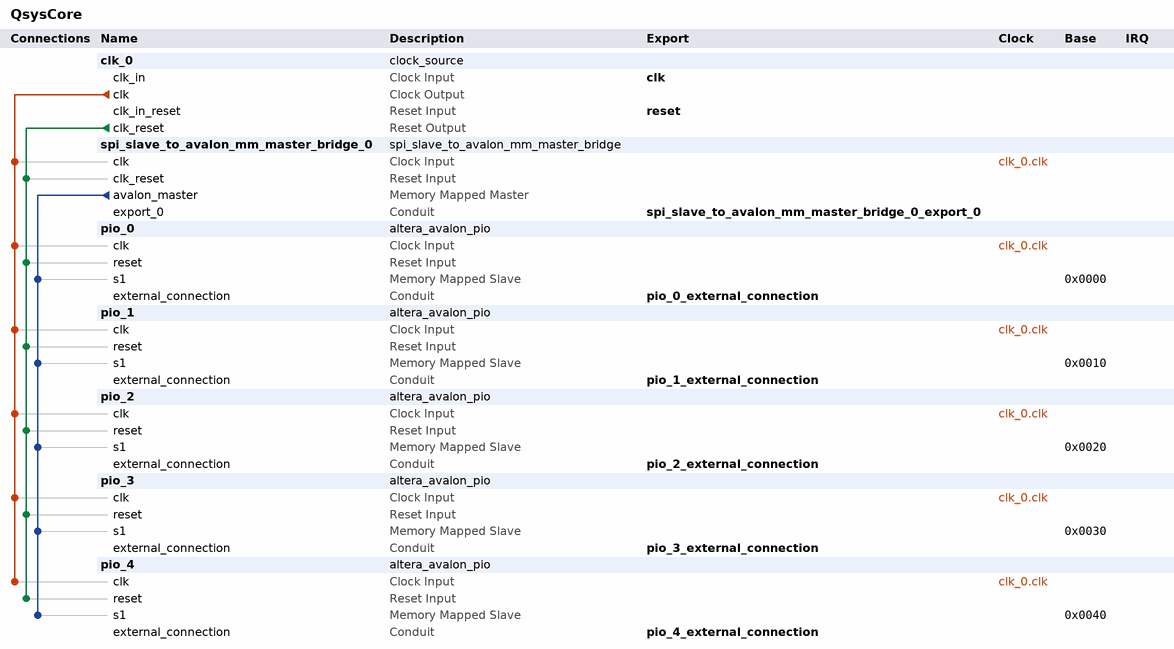
[diagram p0: system contents]
# Platform Designer (Qsys) system QsysCore, MAX 10 10M08SAU169C8G
# Parameters at their usual value, and those the tool derives, are not listed.
package require -exact qsys 18.1
create_system QsysCore
set_project_property DEVICE_FAMILY {MAX 10}
set_project_property DEVICE 10M08SAU169C8G

add_instance clk_0 clock_source 18.1
set_instance_parameter_value clk_0 clockFrequency 48000000

add_instance spi_slave_to_avalon_mm_master_bridge_0 spi_slave_to_avalon_mm_master_bridge 18.1
set_instance_parameter_value spi_slave_to_avalon_mm_master_bridge_0 SYNC_DEPTH 2

add_instance pio_0 altera_avalon_pio 18.1
set_instance_parameter_value pio_0 direction Output
set_instance_parameter_value pio_0 width 32

add_instance pio_1 altera_avalon_pio 18.1
set_instance_parameter_value pio_1 direction Output
set_instance_parameter_value pio_1 width 32

add_instance pio_2 altera_avalon_pio 18.1
set_instance_parameter_value pio_2 direction Output
set_instance_parameter_value pio_2 width 32

add_instance pio_3 altera_avalon_pio 18.1
set_instance_parameter_value pio_3 direction Output
set_instance_parameter_value pio_3 width 32

add_instance pio_4 altera_avalon_pio 18.1
set_instance_parameter_value pio_4 direction Output
set_instance_parameter_value pio_4 width 32

# connections
add_connection clk_0.clk pio_0.clk clock
add_connection clk_0.clk pio_1.clk clock
add_connection clk_0.clk pio_2.clk clock
add_connection clk_0.clk pio_3.clk clock
add_connection clk_0.clk pio_4.clk clock
add_connection clk_0.clk spi_slave_to_avalon_mm_master_bridge_0.clk clock
add_connection clk_0.clk_reset pio_0.reset reset
add_connection clk_0.clk_reset pio_1.reset reset
add_connection clk_0.clk_reset pio_2.reset reset
add_connection clk_0.clk_reset pio_3.reset reset
add_connection clk_0.clk_reset pio_4.reset reset
add_connection clk_0.clk_reset spi_slave_to_avalon_mm_master_bridge_0.clk_reset reset
add_connection spi_slave_to_avalon_mm_master_bridge_0.avalon_master pio_0.s1 avalon
set_connection_parameter_value spi_slave_to_avalon_mm_master_bridge_0.avalon_master/pio_0.s1 baseAddress 0x0000
add_connection spi_slave_to_avalon_mm_master_bridge_0.avalon_master pio_1.s1 avalon
set_connection_parameter_value spi_slave_to_avalon_mm_master_bridge_0.avalon_master/pio_1.s1 baseAddress 0x0010
add_connection spi_slave_to_avalon_mm_master_bridge_0.avalon_master pio_2.s1 avalon
set_connection_parameter_value spi_slave_to_avalon_mm_master_bridge_0.avalon_master/pio_2.s1 baseAddress 0x0020
add_connection spi_slave_to_avalon_mm_master_bridge_0.avalon_master pio_3.s1 avalon
set_connection_parameter_value spi_slave_to_avalon_mm_master_bridge_0.avalon_master/pio_3.s1 baseAddress 0x0030
add_connection spi_slave_to_avalon_mm_master_bridge_0.avalon_master pio_4.s1 avalon
set_connection_parameter_value spi_slave_to_avalon_mm_master_bridge_0.avalon_master/pio_4.s1 baseAddress 0x0040

# exported interfaces
add_interface clk clock sink
set_interface_property clk EXPORT_OF clk_0.clk_in
add_interface pio_0_external_connection conduit end
set_interface_property pio_0_external_connection EXPORT_OF pio_0.external_connection
add_interface pio_1_external_connection conduit end
set_interface_property pio_1_external_connection EXPORT_OF pio_1.external_connection
add_interface pio_2_external_connection conduit end
set_interface_property pio_2_external_connection EXPORT_OF pio_2.external_connection
add_interface pio_3_external_connection conduit end
set_interface_property pio_3_external_connection EXPORT_OF pio_3.external_connection
add_interface pio_4_external_connection conduit end
set_interface_property pio_4_external_connection EXPORT_OF pio_4.external_connection
add_interface reset reset sink
set_interface_property reset EXPORT_OF clk_0.clk_in_reset
add_interface spi_slave_to_avalon_mm_master_bridge_0_export_0 conduit end
set_interface_property spi_slave_to_avalon_mm_master_bridge_0_export_0 EXPORT_OF spi_slave_to_avalon_mm_master_bridge_0.export_0

set_interconnect_requirement {$system} qsys_mm.clockCrossingAdapter HANDSHAKE
set_interconnect_requirement {$system} qsys_mm.enableEccProtection FALSE
set_interconnect_requirement {$system} qsys_mm.insertDefaultSlave FALSE
set_interconnect_requirement {$system} qsys_mm.maxAdditionalLatency 1

save_system QsysCore.qsys
